# EAGLE design Drivetrain_control (EAGLE 9.3.2)

## Sheet 1 of 2: LAUNCHXL-F28379D Headers
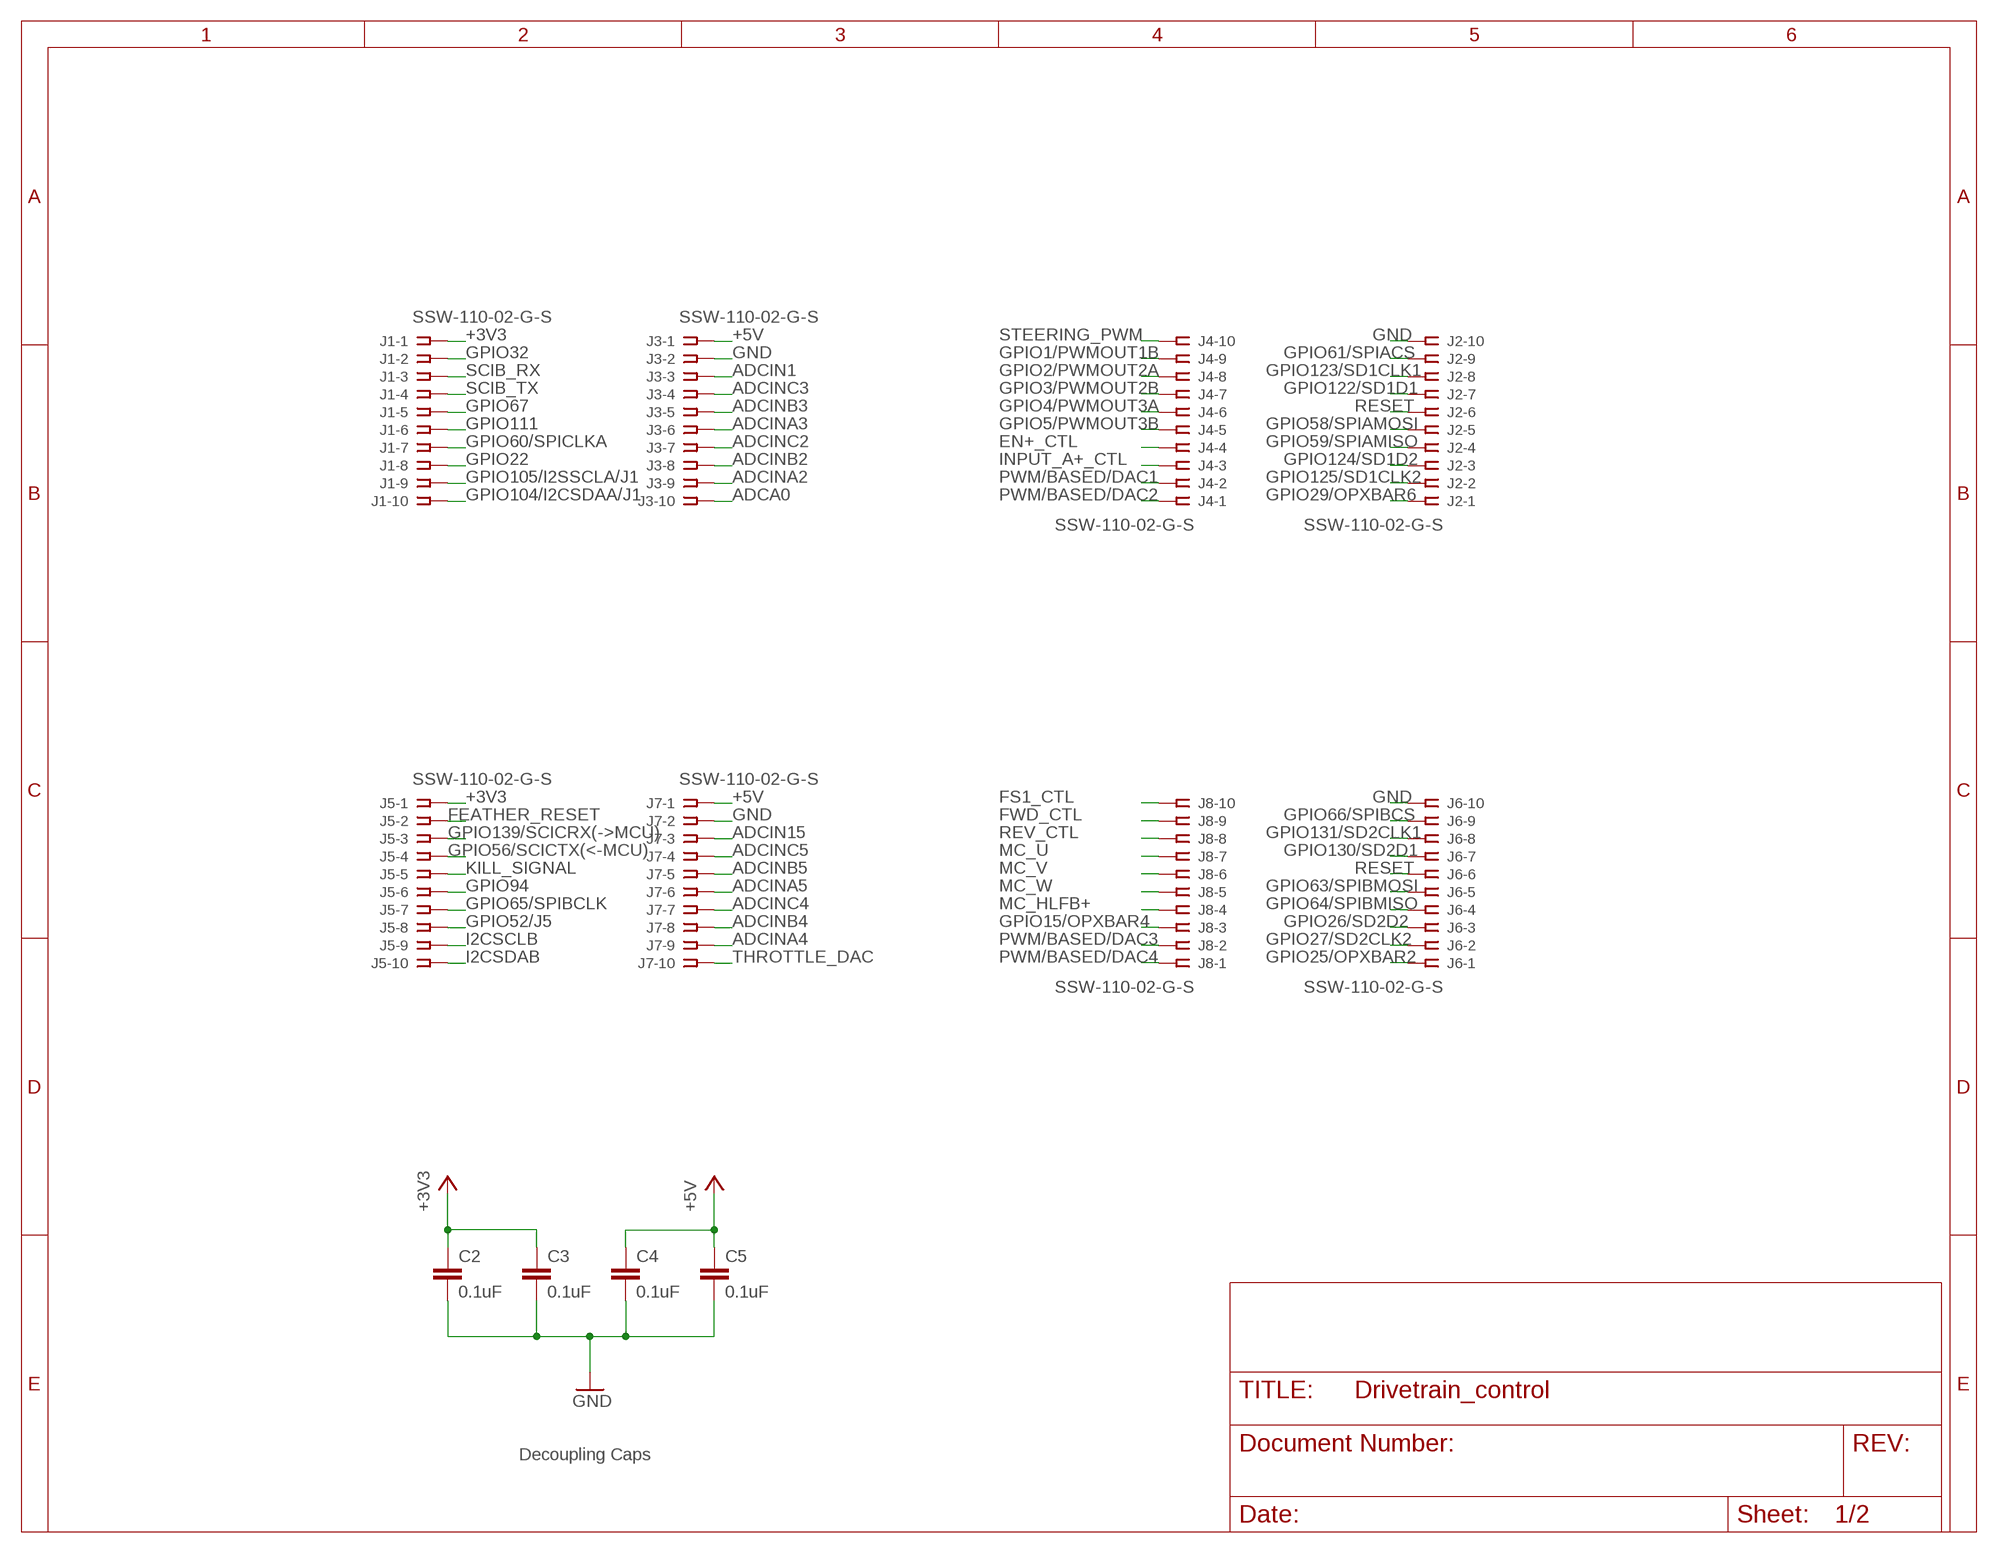
[diagram p0: schematic, sheet 1]

### Parts
C2  0.1uF  C  [C0805]
C3  0.1uF  C  [C0805]
C4  0.1uF  C  [C0805]
C5  0.1uF  C  [C0805]
J1  SSW-110-02-G-S  [SSW-110-02-G-S]
J2  SSW-110-02-G-S  [SSW-110-02-G-S]
J3  SSW-110-02-G-S  [SSW-110-02-G-S]
J4  SSW-110-02-G-S  [SSW-110-02-G-S]
J5  SSW-110-02-G-S  [SSW-110-02-G-S]
J6  SSW-110-02-G-S  [SSW-110-02-G-S]
J7  SSW-110-02-G-S  [SSW-110-02-G-S]
J8  SSW-110-02-G-S  [SSW-110-02-G-S]

### Nets
+3V3: C2.1 C3.1 J1.1 J5.1 ; also sheet 2
+5V: C4.1 C5.1 J3.1 J7.1 ; also sheet 2
ADCA0: J3.10
ADCIN1: J3.3
ADCIN15: J7.3
ADCINA2: J3.9
ADCINA3: J3.6
ADCINA4: J7.9
ADCINA5: J7.6
ADCINB2: J3.8
ADCINB3: J3.5
ADCINB4: J7.8
ADCINB5: J7.5
ADCINC2: J3.7
ADCINC3: J3.4
ADCINC4: J7.7
ADCINC5: J7.4
EN+_CTL: J4.4 ; also sheet 2
FEATHER_RESET: J5.2 ; also sheet 2
FS1_CTL: J8.10 ; also sheet 2
FWD_CTL: J8.9 ; also sheet 2
GND: C2.2 C3.2 C4.2 C5.2 J2.10 J3.2 J6.10 J7.2 ; also sheet 2
GPIO1/PWMOUT1B: J4.9
GPIO2/PWMOUT2A: J4.8
GPIO3/PWMOUT2B: J4.7
GPIO4/PWMOUT3A: J4.6
GPIO5/PWMOUT3B: J4.5
GPIO15/OPXBAR4: J8.3
GPIO22: J1.8
GPIO25/OPXBAR2: J6.1
GPIO26/SD2D2: J6.3
GPIO27/SD2CLK2: J6.2
GPIO29/OPXBAR6: J2.1
GPIO32: J1.2
GPIO52/J5: J5.8
GPIO56/SCICTX(<-MCU): J5.4
GPIO58/SPIAMOSI: J2.5
GPIO59/SPIAMISO: J2.4
GPIO60/SPICLKA: J1.7
GPIO61/SPIACS: J2.9
GPIO63/SPIBMOSI: J6.5
GPIO64/SPIBMISO: J6.4
GPIO65/SPIBCLK: J5.7
GPIO66/SPIBCS: J6.9
GPIO67: J1.5
GPIO94: J5.6
GPIO104/I2CSDAA/J1: J1.10
GPIO105/I2SSCLA/J1: J1.9
GPIO111: J1.6
GPIO122/SD1D1: J2.7
GPIO123/SD1CLK1: J2.8
GPIO124/SD1D2: J2.3
GPIO125/SD1CLK2: J2.2
GPIO130/SD2D1: J6.7
GPIO131/SD2CLK1: J6.8
GPIO139/SCICRX(->MCU): J5.3
I2CSCLB: J5.9 ; also sheet 2
I2CSDAB: J5.10 ; also sheet 2
INPUT_A+_CTL: J4.3 ; also sheet 2
KILL_SIGNAL: J5.5 ; also sheet 2
MC_HLFB+: J8.4 ; also sheet 2
MC_U: J8.7 ; also sheet 2
MC_V: J8.6 ; also sheet 2
MC_W: J8.5 ; also sheet 2
PWM/BASED/DAC1: J4.2
PWM/BASED/DAC2: J4.1
PWM/BASED/DAC3: J8.2
PWM/BASED/DAC4: J8.1
RESET: J2.6 J6.6
REV_CTL: J8.8 ; also sheet 2
SCIB_RX: J1.3 ; also sheet 2
SCIB_TX: J1.4 ; also sheet 2
STEERING_PWM: J4.10
THROTTLE_DAC: J7.10 ; also sheet 2

### Notes on the sheet
- Decoupling Caps

## Sheet 2 of 2: LAUNCHXL-F28379D Breakout
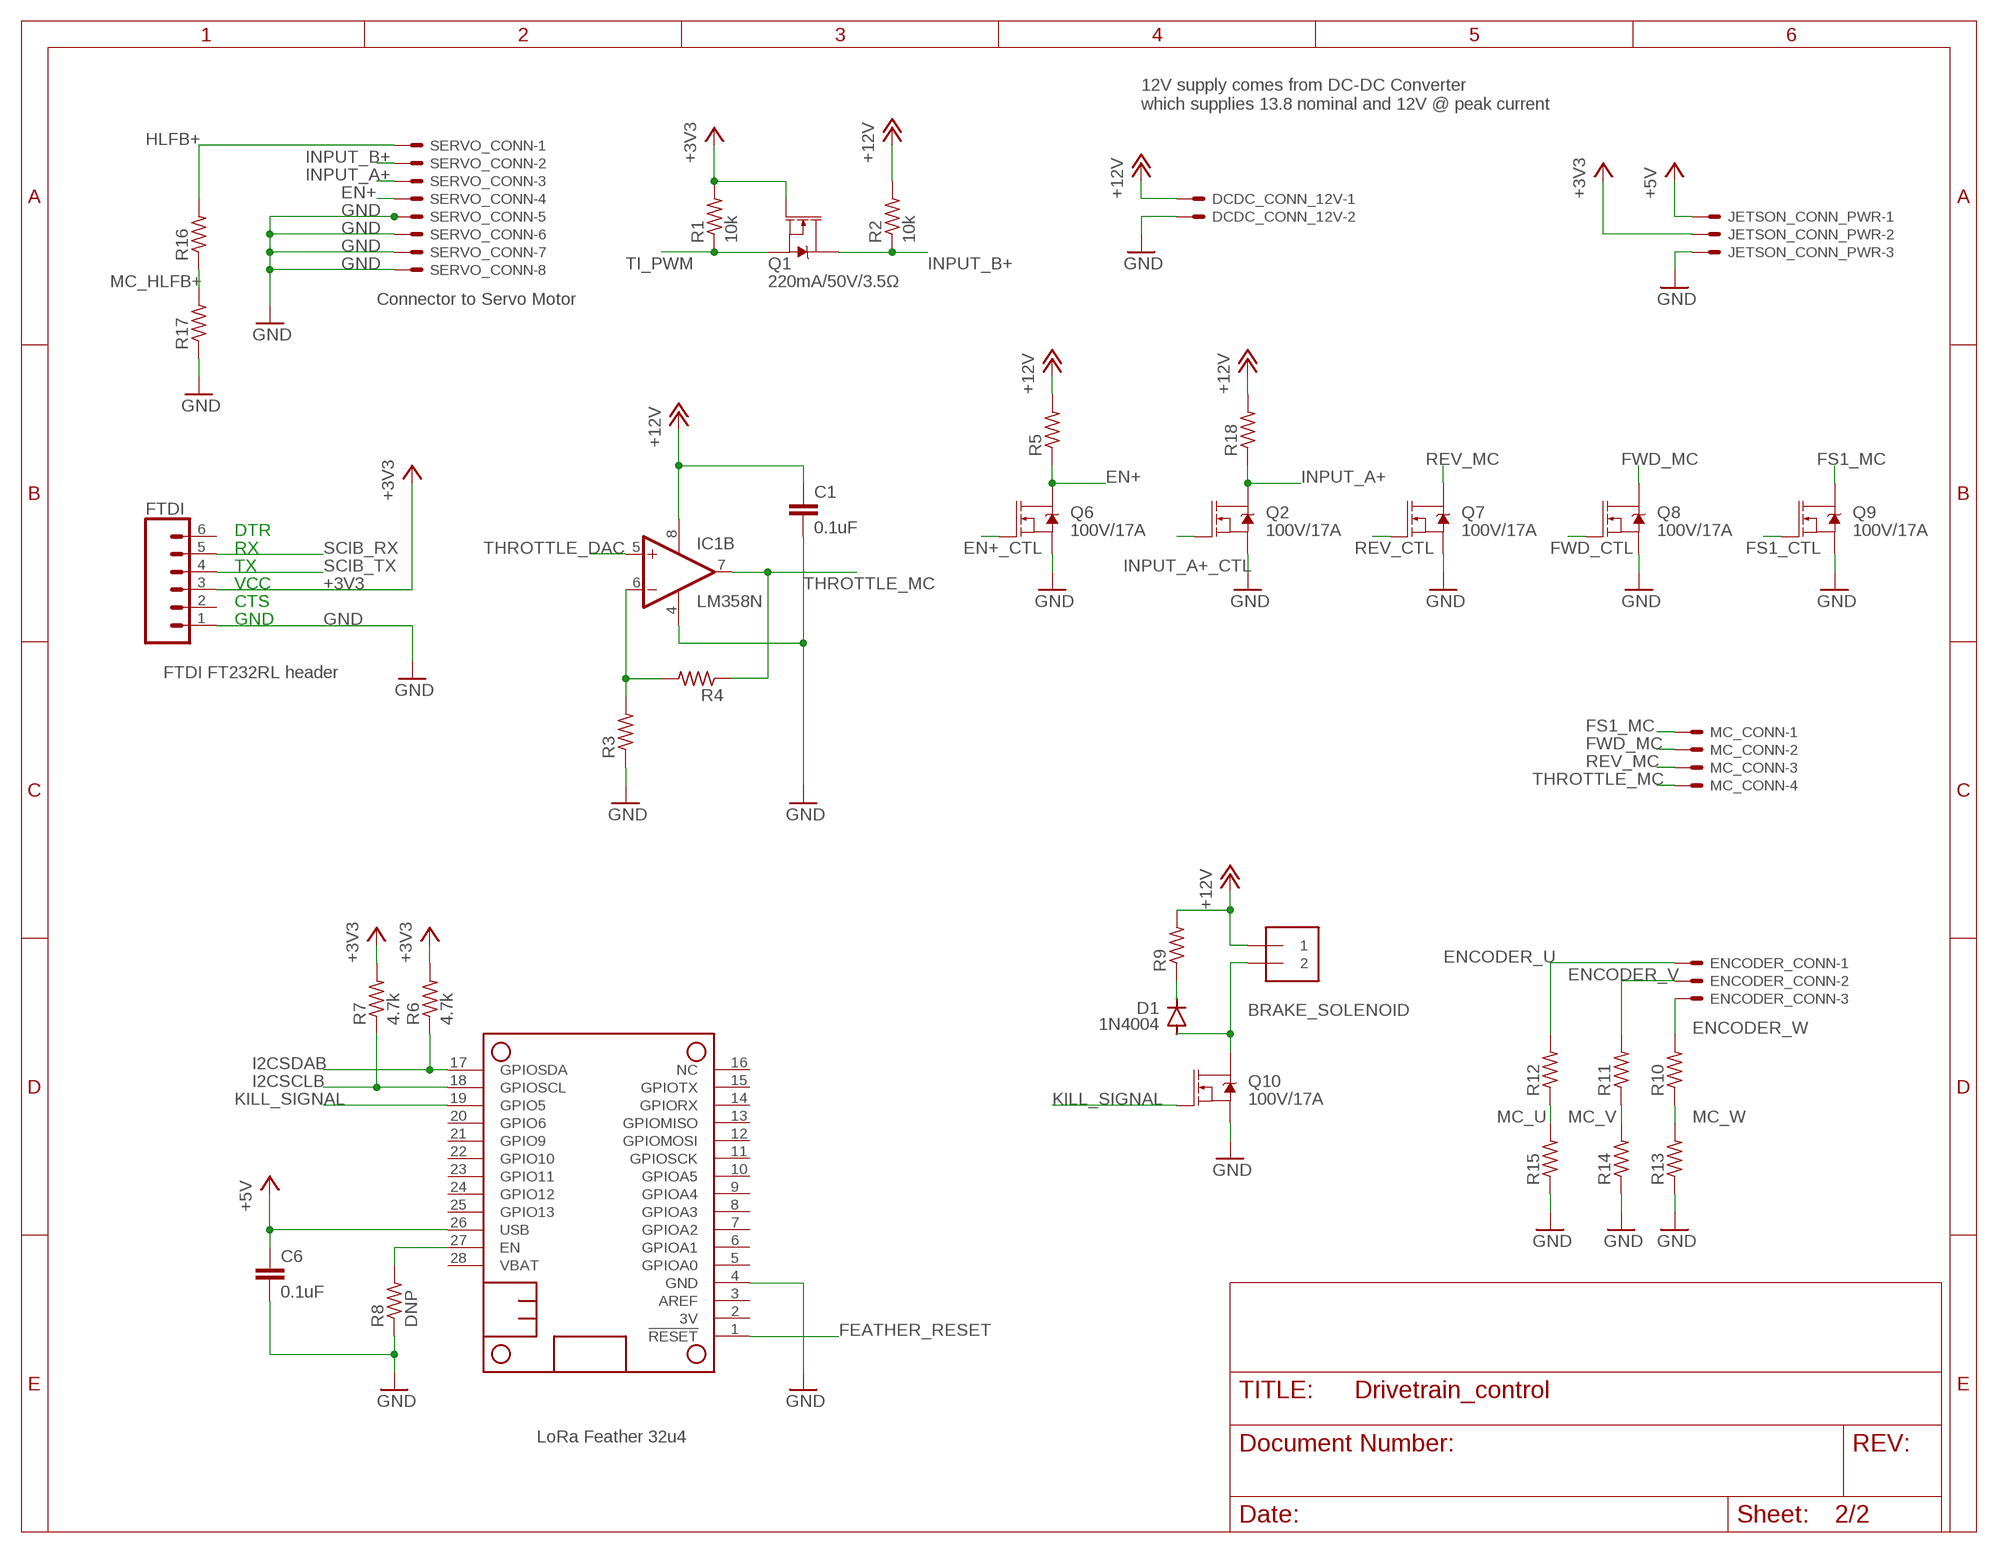
[diagram p1: schematic, sheet 2]

### Parts
BRAKE_CONN  1X2-3.5MM  [1X2-3.5MM]
C1  0.1uF  C  [C0805]
C6  0.1uF  C  [C0805]
D1  1N4004  [DO41-10]
DCDC_CONN_12V  22-23-2021  [22-23-2021]
ENCODER_CONN  22-23-2031  [22-23-2031]
FTDI  CONN_06LONGPADS  [1X06_LONGPADS]
IC1  LM358N  [DIL08]
JETSON_CONN_PWR  22-23-2031  [22-23-2031]
MC_CONN  22-23-2041  [22-23-2041]
MS1  FEATHERWING_NODIM  [FEATHERWING_DIM]
Q1  220mA/50V/3.5Ω  MOSFET-NCH-BSS138  [SOT23-3]
Q2  100V/17A  MOSFET-NCH-FQP30N06L  [TO220V]
Q6  100V/17A  MOSFET-NCH-FQP30N06L  [TO220V]
Q7  100V/17A  MOSFET-NCH-FQP30N06L  [TO220V]
Q8  100V/17A  MOSFET-NCH-FQP30N06L  [TO220V]
Q9  100V/17A  MOSFET-NCH-FQP30N06L  [TO220V]
Q10  100V/17A  MOSFET-NCH-FQP30N06L  [TO220V]
R1  10k  R-US_R0805  [R0805]
R2  10k  R-US_R0805  [R0805]
R3  R-US_R0805  [R0805]
R4  R-US_R0805  [R0805]
R5  R-US_R0805  [R0805]
R6  4.7k  R-US_R0805  [R0805]
R7  4.7k  R-US_R0805  [R0805]
R8  DNP  R-US_R0805  [R0805]
R9  R-US_R0805  [R0805]
R10  R-US_R0805  [R0805]
R11  R-US_R0805  [R0805]
R12  R-US_R0805  [R0805]
R13  R-US_R0805  [R0805]
R14  R-US_R0805  [R0805]
R15  R-US_R0805  [R0805]
R16  R-US_R0805  [R0805]
R17  R-US_R0805  [R0805]
R18  R-US_R0805  [R0805]
SERVO_CONN  5566-8  [5566-8]

### Nets
+3V3: FTDI.3 JETSON_CONN_PWR.2 Q1.1(G) R1.2 R6.2 R7.2 ; also sheet 1
+5V: C6.1 JETSON_CONN_PWR.1 MS1.26(USB) ; also sheet 1
+12V: BRAKE_CONN.1 C1.1 DCDC_CONN_12V.1 IC1.8(P:V+) R2.2 R5.2 R9.2 R18.2
BRAKE_SOLENOID: BRAKE_CONN.2 D1.A Q10.2(D)
EN+: Q6.2(D) R5.1 SERVO_CONN.4
EN+_CTL: Q6.1(G) ; also sheet 1
ENCODER_U: ENCODER_CONN.1 R12.2
ENCODER_V: ENCODER_CONN.2 R11.2
ENCODER_W: ENCODER_CONN.3 R10.2
FEATHER_RESET: MS1.1(!RESET) ; also sheet 1
FS1_CTL: Q9.1(G) ; also sheet 1
FS1_MC: MC_CONN.1 Q9.2(D)
FWD_CTL: Q8.1(G) ; also sheet 1
FWD_MC: MC_CONN.2 Q8.2(D)
GND: C1.2 C6.2 DCDC_CONN_12V.2 FTDI.1 IC1.4(P:V-) JETSON_CONN_PWR.3 MS1.4(GND) Q2.3(S) Q6.3(S) Q7.3(S) Q8.3(S) Q9.3(S) Q10.3(S) R3.1 R8.1 R13.1 R14.1 R15.1 R17.1 SERVO_CONN.5 SERVO_CONN.6 SERVO_CONN.7 SERVO_CONN.8 ; also sheet 1
HLFB+: R16.2 SERVO_CONN.1
I2CSCLB: MS1.18(GPIOSCL) R7.1 ; also sheet 1
I2CSDAB: MS1.17(GPIOSDA) R6.1 ; also sheet 1
INPUT_A+: Q2.2(D) R18.1 SERVO_CONN.3
INPUT_A+_CTL: Q2.1(G) ; also sheet 1
INPUT_B+: Q1.3(D) R2.1 SERVO_CONN.2
KILL_SIGNAL: MS1.19(GPIO5) Q10.1(G) ; also sheet 1
MC_HLFB+: R16.1 R17.2 ; also sheet 1
MC_U: R12.1 R15.2 ; also sheet 1
MC_V: R11.1 R14.2 ; also sheet 1
MC_W: R10.1 R13.2 ; also sheet 1
N$1: IC1.6(B:-IN) R3.2 R4.2
N$2: D1.C R9.1
N$3: MS1.27(EN) R8.2
REV_CTL: Q7.1(G) ; also sheet 1
REV_MC: MC_CONN.3 Q7.2(D)
SCIB_RX: FTDI.5 ; also sheet 1
SCIB_TX: FTDI.4 ; also sheet 1
THROTTLE_DAC: IC1.5(B:+IN) ; also sheet 1
THROTTLE_MC: IC1.7(B:OUT) MC_CONN.4 R4.1
TI_PWM: Q1.2(S) R1.1
Unconnected: FTDI.2 FTDI.6 IC1.1(A:OUT) IC1.2(A:-IN) IC1.3(A:+IN) MS1.2(3V) MS1.3(AREF) MS1.5(GPIOA0) MS1.6(GPIOA1) MS1.7(GPIOA2) MS1.8(GPIOA3) MS1.9(GPIOA4) MS1.10(GPIOA5) MS1.11(GPIOSCK) MS1.12(GPIOMOSI) MS1.13(GPIOMISO) MS1.14(GPIORX) MS1.15(GPIOTX) MS1.16(NC) MS1.20(GPIO6) MS1.21(GPIO9) MS1.22(GPIO10) MS1.23(GPIO11) MS1.24(GPIO12) MS1.25(GPIO13) MS1.28(VBAT)

### Notes on the sheet
- 12V supply comes from DC-DC Converter
  which supplies 13.8 nominal and 12V @ peak current
- Connector to Servo Motor
- DTR
- RX
- TX
- VCC
- CTS
- GND
- FTDI FT232RL header
- LoRa Feather 32u4

## Library data of the parts
BRAKE_CONN = adafruit:1X2: 3.5mm Terminal block http://www.ladyada.net/library/pcb/eaglelibrary.html
C1-C6 = eagle-ltspice:C: CAPACITOR, European symbol; SPICEMODEL: NONE; SPICEPREFIX: C
D1 = diode:1N4004: DIODE general purpose rectifier, 1 A
DCDC_CONN_12V = con-molex:22-23-2021: .100" (2.54mm) Center Header - 2 Pin; MF: MOLEX; MPN: 22-23-2021; OC_FARNELL: 1462926; OC_NEWARK: 25C3832
ENCODER_CONN JETSON_CONN_PWR = con-molex:22-23-2031: .100" (2.54mm) Center Header - 3 Pin; MF: MOLEX; MPN: 22-23-2031; OC_FARNELL: 1462950; OC_NEWARK: 30C0862
FTDI = SparkFun-Connectors:CONN_06: Multi connection point. Often used as Generic Header-pin footprint for 0.1 inch spaced/style header connections On any of the 0.1 inch spaced packages, you can populate with these: Break Away Headers - Straight <https://www.sparkfun.com/products/116> (PRT-00116) Break Away Male Headers - Right Angle <https://www.sparkfun.com/products/553> (PRT-00553) Female Headers <https://www.sparkfun.com/products/115> (PRT-00115) Break Away Headers - Machine Pin <https://www.sparkfun.com/products/117> (PRT-00117) Break Away Female Headers - Swiss Machine Pin <https://www.sparkfun.com/products/743> (PRT-00743) Arduino Stackable Header - 6 Pin <https://www.sparkfun.com/products/9280> (PRT-09280) For SCREWTERMINALS and SPRING TERMINALS visit here: Screw Terimnals on SparkFun.com <https://www.sparkfun.com/search/results?term=Screw+Terminals> (5mm/3.5mm/2.54mm spacing) This device is also useful as a general connection point to wire up your design to another part of your project. Our various solder wires solder well into these plated through hole pads. Hook-Up Wire - Assortment (Stranded, 22 AWG) <https://www.sparkfun.com/products/11375> (PRT-11375) Hook-Up Wire - Assortment (Solid Core, 22 AWG) <https://www.sparkfun.com/products/11367> (PRT-11367) View the entire wire category on our website here <https://www.sparkfun.com/categories/141>
IC1 = linear:LM358: OP AMP also LM158; LM258; LM2904 Source: http://cache.national.com/ds/LM/LM158.pdf
J1-J8 = con-samtec:SSW-110-02-G-S: THROUGH-HOLE .025" SQ POST SOCKET Source: Samtec SSW.pdf; MF: Samtec Inc.; MPN: SSW-110-02-G-S; OC_FARNELL: unknown; OC_NEWARK: 11P9482
MC_CONN = con-molex:22-23-2041: .100" (2.54mm) Center Header - 4 Pin; MF: MOLEX; MPN: 22-23-2041; OC_FARNELL: 1462920; OC_NEWARK: 38C0355
MS1 = adafruit:FEATHERWING
Q1 = SparkFun-DiscreteSemi:MOSFET-NCH: N-channel MOSFETs Voltage controlled devices that allow control of high current outputs. SparkFun Products: SparkFun OpenScale <https://www.sparkfun.com/products/13261> SparkFun Digital Sandbox <https://www.sparkfun.com/products/12651> SparkFun Monster Moto Shield <https://www.sparkfun.com/products/10182> SparkFun MOSFET Power Controller <https://www.sparkfun.com/products/11214>; PROD_ID: TRANS-00830
Q2 Q6-Q10 = SparkFun-DiscreteSemi:MOSFET-NCH: N-channel MOSFETs Voltage controlled devices that allow control of high current outputs. SparkFun Products: SparkFun OpenScale <https://www.sparkfun.com/products/13261> SparkFun Digital Sandbox <https://www.sparkfun.com/products/12651> SparkFun Monster Moto Shield <https://www.sparkfun.com/products/10182> SparkFun MOSFET Power Controller <https://www.sparkfun.com/products/11214>; PROD_ID: TRANS-10060; VALUE: 60V/32A/35mΩ
R1-R18 = resistor:R-US_: RESISTOR, American symbol
SERVO_CONN = con-molex:5566-8: Mini FIT connector 8 pol Source: http://www.molex.com; MF: MOLEX; OC_FARNELL: unknown; OC_NEWARK: unknown

## Board
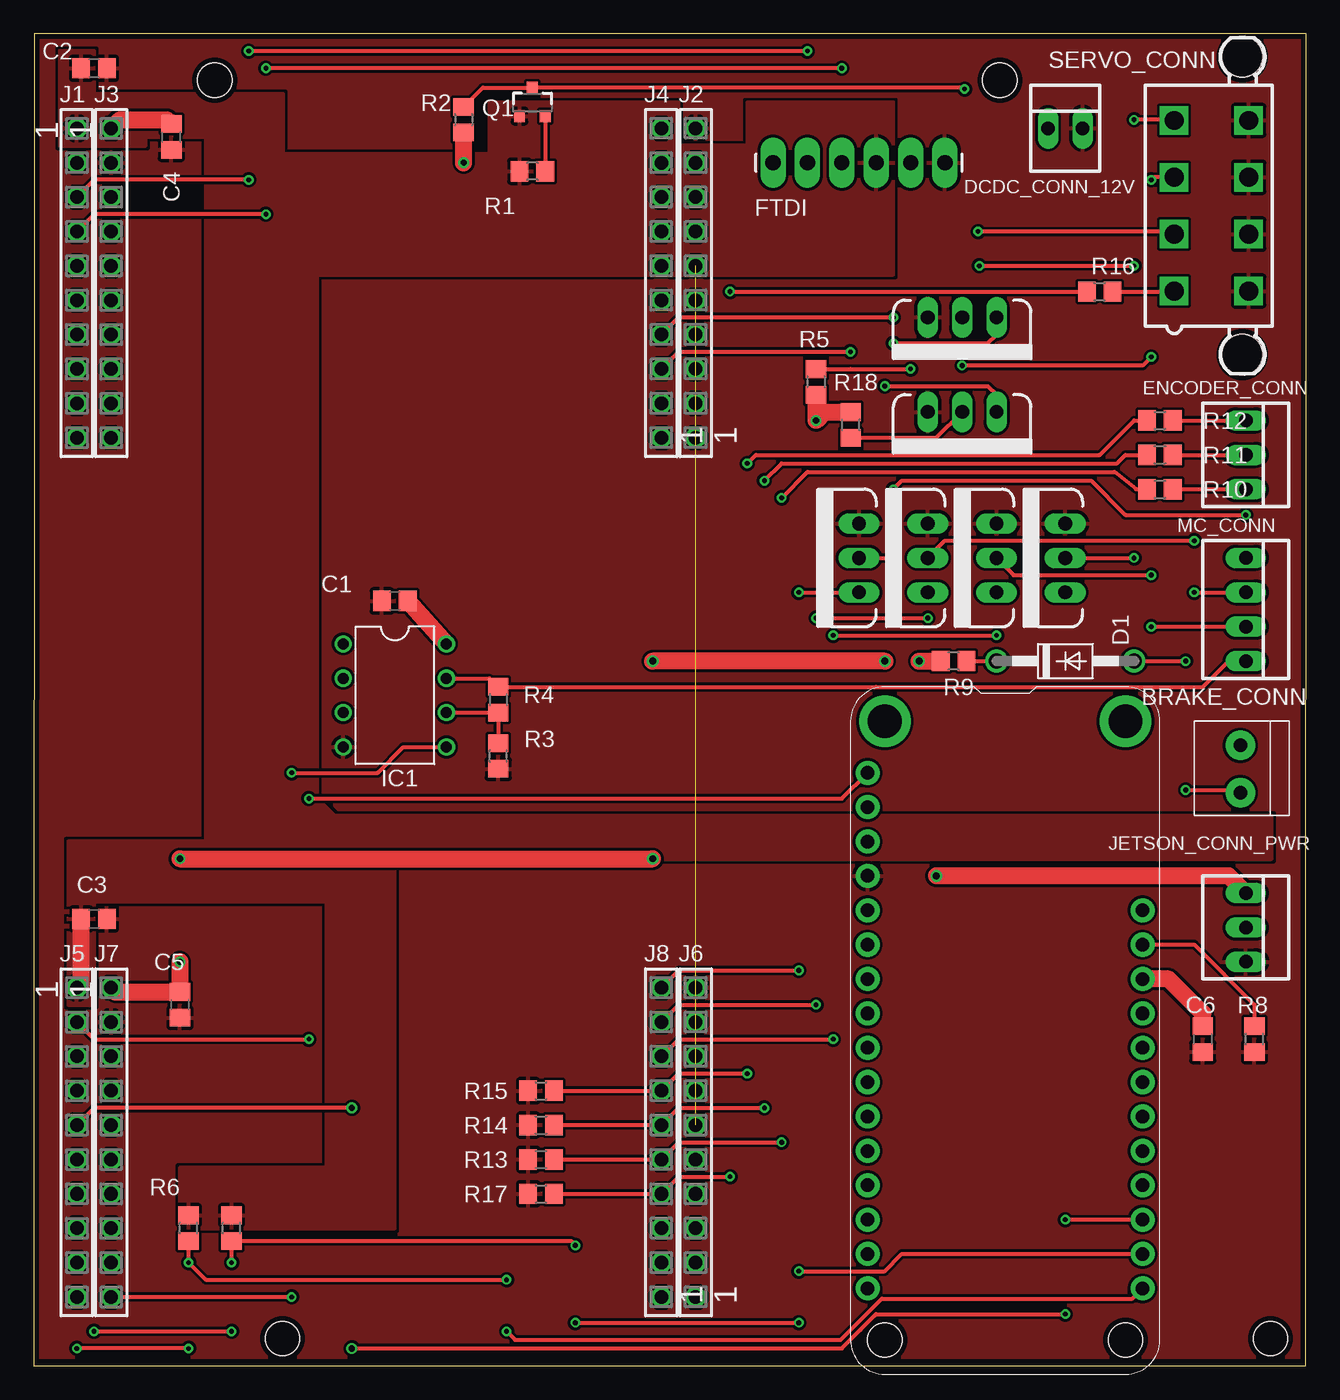
[diagram p2: board, top side]
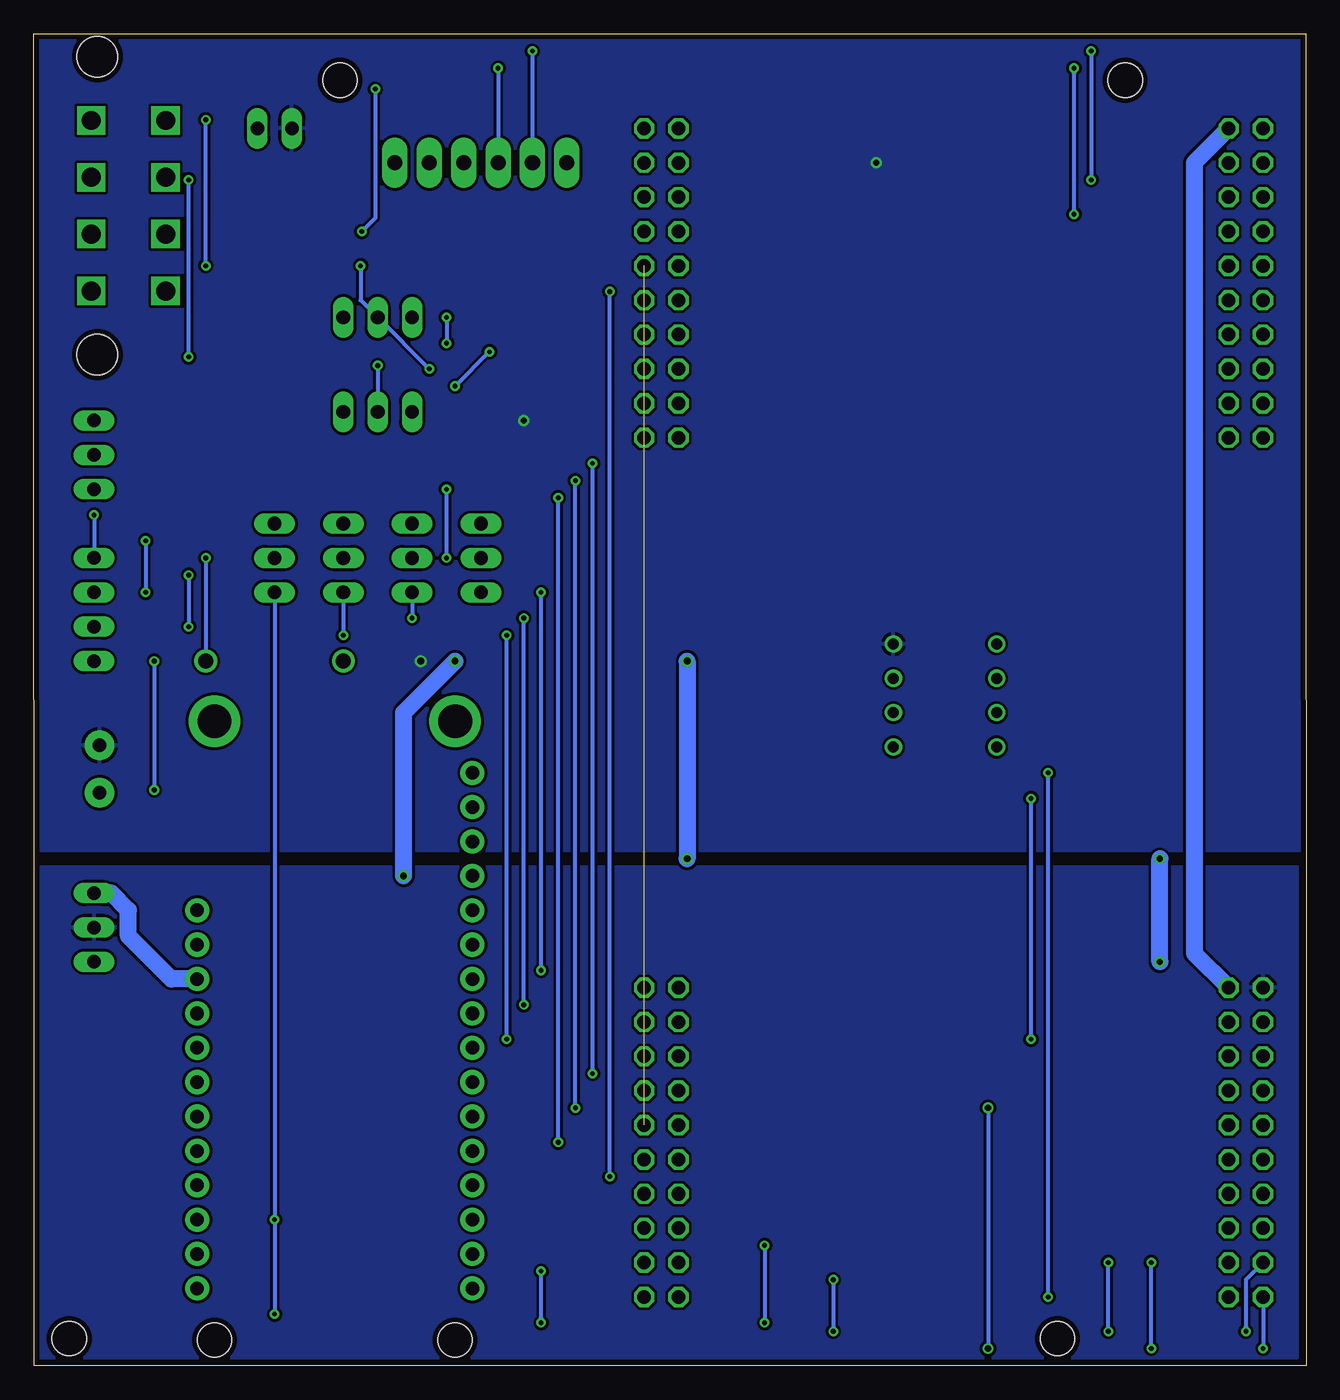
[diagram p3: board, bottom side, seen from below]

Size 93.99 x 98.43 mm. Coordinates in mm from the lower left corner, seen from the top.
Outline: 0,0 93.96,0 93.98,98.42 0.03,98.42 0,0
Copper layers (1*16): Top 0.0356mm / dielectric 1.5011mm / Bottom 0.0356mm
Design rules "ECE_Senior_Design": minimum track width 8mil, minimum drill 13mil, track to track 8mil, track to pad 8mil, pad to pad 6mil, via to via 8mil, smd to smd 6mil, copper to edge 15mil, drill to drill 8mil, minimum pad ring 7mil, minimum via ring 7mil, stop-mask expansion 3mil, vias tented up to drill 0mil, thermal gap 10mil
Holes 2.54 mm at 91.36,2 18.36,2 13.37,95 71.36,95

### Footprints (pad centres in the part's own frame; a part is rotated, then mirrored left to right if it is on the bottom)
1X2-3.5MM = drill 1 pad 2.184: 1 1.8,0; 2 -1.7,0
C0805 = smd 1.3 x 1.5: 1 -0.95,0; 2 0.95,0
DO41-10 = drill 1.118: A 5.08,0; C -5.08,0
22-23-2021 = drill 1 long: 1 -1.27,0; 2 1.27,0
22-23-2031 = drill 1 long: 1 -2.54,0; 2 0,0; 3 2.54,0
1X06_LONGPADS = drill 1.118 pad 1.88 long: 1 0,0; 2 2.54,0; 3 5.08,0; 4 7.62,0; 5 10.16,0; 6 12.7,0
DIL08 = drill 0.813 pad 1.27: 1 -3.81,-3.81; 2 -1.27,-3.81; 3 1.27,-3.81; 4 3.81,-3.81; 5 3.81,3.81; 6 1.27,3.81; 7 -1.27,3.81; 8 -3.81,3.81
SSW-110-02-G-S = drill 1 pad 1.5 octagon: 1 -11.43,0; 2 -8.89,0; 3 -6.35,0; 4 -3.81,0; 5 -1.27,0; 6 1.27,0; 7 3.81,0; 8 6.35,0; 9 8.89,0; 10 11.43,0
22-23-2041 = drill 1 long: 1 -3.81,0; 2 -1.27,0; 3 1.27,0; 4 3.81,0
FEATHERWING_DIM = drill 1 pad 1.778: 1 6.35,1.27; 2 8.89,1.27; 3 11.43,1.27; 4 13.97,1.27; 5 16.51,1.27; 6 19.05,1.27; 7 21.59,1.27; 8 24.13,1.27; 9 26.67,1.27; 10 29.21,1.27; 11 31.75,1.27; 12 34.29,1.27; 13 36.83,1.27; 14 39.37,1.27; 15 41.91,1.27; 16 44.45,1.27; 17 44.45,21.59; 18 41.91,21.59; 19 39.37,21.59; 20 36.83,21.59; 21 34.29,21.59; 22 31.75,21.59; 23 29.21,21.59; 24 26.67,21.59; 25 24.13,21.59; 26 21.59,21.59; 27 19.05,21.59; 28 16.51,21.59 | drill 2.5 pad 3.81: P$1 2.54,20.32; P$2 2.54,2.54 | hole 2.54: 48.26,20.32; 48.26,2.54
SOT23-3 = smd 0.8 x 0.9: 1 -0.95,-1; 2 0.95,-1; 3 0,1.1
TO220V = drill 1.016 long: 1 -2.54,0; 2 0,0; 3 2.54,0
R0805 = smd 1.3 x 1.5: 1 -0.95,0; 2 0.95,0
5566-8 = drill 1.4 square: 1 6.3,-2.75; 2 2.1,-2.75; 3 -2.1,-2.75; 4 -6.3,-2.75; 5 6.3,2.75; 6 2.1,2.75; 7 -2.1,2.75; 8 -6.3,2.75 | hole 3: 11,2.29; -11,2.29

### Placement (x,y rotation side)
BRAKE_CONN  89.13,44.04 90 top
C1  26.67,56.52 180 top
C2  4.45,95.89 0 top
C3  4.45,33.02 0 top
C4  10.16,90.81 270 top
C5  10.79,26.67 270 top
C6  86.36,24.13 270 top
D1  76.2,52.07 0 top
DCDC_CONN_12V  76.2,91.44 0 top
ENCODER_CONN  89.53,67.31 270 top
FTDI  67.31,88.9 180 top
IC1  26.67,49.53 270 top
J1  3.17,80.01 270 top
J2  48.9,80.01 90 top
J3  5.71,80.01 270 top
J4  46.36,80.01 90 top
J5  3.17,16.51 270 top
J6  48.9,16.51 90 top
J7  5.71,16.51 270 top
J8  46.36,16.51 90 top
JETSON_CONN_PWR  89.53,32.38 270 top
MC_CONN  89.53,55.88 270 top
MS1  60.33,50.16 270 top
Q1  36.83,93.34 0 top
Q2  68.58,70.48 180 top
Q6  68.58,77.47 180 top
Q7  71.12,59.69 90 top
Q8  66.04,59.69 90 top
Q9  60.96,59.69 90 top
Q10  76.2,59.69 90 top
R1  36.83,88.27 180 top
R2  31.75,92.08 270 top
R3  34.32,45.06 90 top
R4  34.32,49.21 270 top
R5  57.79,72.69 270 top
R6  11.43,10.16 90 top
R7  14.61,10.16 90 top
R8  90.17,24.13 90 top
R9  67.94,52.07 180 top
R10  83.18,64.77 0 top
R11  83.18,67.31 0 top
R12  83.18,69.85 0 top
R13  37.47,15.24 0 top
R14  37.47,17.78 0 top
R15  37.47,20.32 0 top
R16  78.74,79.38 0 top
R17  37.47,12.7 0 top
R18  60.35,69.52 90 top
SERVO_CONN  86.99,85.72 270 top

### Tracks (layer width: path | path; a pad name or v marks a point on that pad's centre or on a via)
+3V3
  Top 1.27: J5.1 arc90 3.5,28.26 C3.1
  pour Bottom: 0.64,36.83 93.98,36.83 93.98,0.64 0.64,0.64
  pour Top: 1.91,90.17 8.26,90.17 8.26,90.81 12.7,90.81 12.7,38.73 2.54,38.73 2.54,26.67 4.45,26.67 4.45,34.29 21.59,34.29 21.59,14.61 10.79,14.61 10.79,10.16 26.67,10.16 26.67,37.47 91.44,37.47 91.44,40.64 22.22,40.64 20.95,41.91 20.95,80.64 63.5,80.64 63.5,93.34 52.71,93.34 52.71,90.17 47.62,90.17 47.62,93.34 33.66,93.34 33.66,89.53 18.41,89.53 18.41,93.98 4.45,93.98 4.45,97.16 1.91,97.16
+5V  (via drill 0.45, 0.5)
  Top 1.27: J7.1 6.04,27.62 C5.1 v10.79,29.84 | J3.1 6.35,92.08 9.84,92.08 C4.1 | C6.1 86.36,26.04 83.82,28.57 MS1.26 | JETSON_CONN_PWR.1 88.27,36.2 v66.67,36.2 | v62.87,52.07 v45.72,52.07 | v10.79,37.47 v45.72,37.47
  Bottom 1.27: J3.1 8.26,88.9 8.26,30.48 J7.1 | v10.79,29.84 v10.79,37.47 | MS1.26 83.82,28.57 86.99,31.75 86.99,33.66 88.27,34.92 JETSON_CONN_PWR.1 | v66.67,36.2 66.67,48.26 v62.87,52.07 | v45.72,52.07 v45.72,37.47
+12V  (via drill 0.45, 0.5)
  Top 1.27: R5.2 v57.79,69.85 58.41,70.47 R18.2 | v31.75,88.9 R2.2 | C1.1 IC1.8 | v65.41,52.07 R9.2
  pour Bottom: 0,98.42 93.98,98.42 93.98,38.1 0,38.1
BRAKE_SOLENOID  (via drill 0.35)
  Top 0.305: Q10.2 v81.28,59.69 | D1.A v85.09,52.07 | v85.09,42.55 88.9,42.55 BRAKE_CONN.2
  Bottom 0.305: v81.28,59.69 D1.A | v85.09,52.07 v85.09,42.55
EN+  (via drill 0.35)
  Top 0.305: R5.1 60.33,73.66 v64.77,73.66 | v69.85,81.28 v81.28,81.28 | SERVO_CONN.4 84.19,92.08 v81.28,92.08
  Bottom 0.305: v69.85,81.28 69.85,78.74 Q6.2 v64.77,73.66 | v81.28,81.28 v81.28,92.08
EN+_CTL  (via drill 0.35)
  Top 0.305: J4.4 47.62,77.47 v63.5,77.47 | v63.5,75.56 70.48,75.56 71.12,76.2 Q6.1
  Bottom 0.305: v63.5,77.47 v63.5,75.56
ENCODER_U
  Top 0.305: R12.2 ENCODER_CONN.1
ENCODER_V
  Top 0.305: R11.2 ENCODER_CONN.2
ENCODER_W
  Top 0.305: R10.2 ENCODER_CONN.3
FEATHER_RESET  (via drill 0.35)
  Top 0.305: J5.2 4.45,24.13 v20.32,24.13 | v20.32,41.91 59.69,41.91 MS1.1
  Bottom 0.305: v20.32,24.13 v20.32,41.91
FS1_CTL  (via drill 0.35)
  Top 0.305: J8.10 47.62,29.21 v56.52,29.21 | v56.52,57.15 Q9.1
  Bottom 0.305: v56.52,29.21 v56.52,57.15
FS1_MC  (via drill 0.35)
  Top 0.305: v89.53,62.87 80.64,62.87 78.1,65.41 64.13,65.41 v63.5,64.77 | Q9.2 v63.5,59.69
  Bottom 0.305: v89.53,62.87 MC_CONN.1 | v63.5,59.69 v63.5,64.77
FWD_CTL  (via drill 0.35)
  Top 0.305: J8.9 47.62,26.67 v57.79,26.67 | v57.79,55.24 v66.04,55.24
  Bottom 0.305: v57.79,26.67 v57.79,55.24 | Q8.1 v66.04,55.24
FWD_MC  (via drill 0.35)
  Top 0.305: v85.72,57.15 MC_CONN.2 | Q8.2 67.31,60.96 v85.72,60.96
  Bottom 0.305: v85.72,60.96 v85.72,57.15
GND
  pour Top (rank 2): 0,98.42 93.98,98.42 93.98,0.64 0,0.64
HLFB+
  Top 0.305: SERVO_CONN.1 83.18,79.38 R16.2
I2CSCLB  (via drill 0.35)
  Top 0.305: v4.45,2.54 v14.61,2.54 | v14.61,7.62 R7.1 39.69,9.21 v40.01,8.89 | v40.01,3.17 v56.52,3.17 | v56.52,6.99 62.87,6.99 64.13,8.26 MS1.18
  Bottom 0.305: J5.9 4.45,6.35 v4.45,2.54 | v14.61,2.54 v14.61,7.62 | v40.01,8.89 v40.01,3.17 | v56.52,3.17 v56.52,6.99
I2CSDAB  (via drill 0.35)
  Top 0.305: v11.43,1.27 v3.17,1.27 | R6.1 v11.43,7.62 12.7,6.35 v34.93,6.35 | MS1.17 81.15,4.95 62.64,4.95 59.6,1.91 35.56,1.91 v34.93,2.54
  Bottom 0.305: J5.10 v3.17,1.27 | v11.43,1.27 v11.43,7.62 | v34.93,6.35 v34.93,2.54
INPUT_A+  (via drill 0.35)
  Top 0.305: v82.55,74.55 81.91,73.91 v68.58,73.91 | SERVO_CONN.3 82.74,87.83 v82.55,87.63 | R18.1 66.66,68.57 Q2.2
  Bottom 0.305: v68.58,73.91 Q2.2 | v82.55,74.55 v82.55,87.63
INPUT_A+_CTL  (via drill 0.35)
  Top 0.305: J4.3 47.62,74.93 v60.33,74.93 | v62.87,72.39 70.48,72.39 71.12,71.75 Q2.1
  Bottom 0.305: v60.33,74.93 v62.87,72.39
INPUT_B+  (via drill 0.35)
  Top 0.305: R2.1 33.17,94.44 Q1.3 68.66,94.44 v68.75,94.34 | SERVO_CONN.2 84.05,83.82 v69.75,83.82
  Bottom 0.305: v68.75,94.34 68.75,84.82 v69.75,83.82
KILL_SIGNAL  (via drill 0.35, 0.45)
  Top 0.305: v23.49,19.05 4.45,19.05 J5.5 | MS1.19 v76.2,10.79 | v23.49,1.27 59.69,1.27 61.06,2.64 61.06,2.65 62.12,3.71 62.13,3.71 62.23,3.81 v76.2,3.81
  Bottom 0.305: v23.49,19.05 v23.49,1.27 | v76.2,3.81 v76.2,10.79 Q10.1
MC_HLFB+  (via drill 0.35)
  Top 0.305: R17.2 J8.4 47.62,13.97 v51.44,13.97 | v51.44,79.38 R16.1
  Bottom 0.305: v51.44,13.97 v51.44,79.38
MC_U  (via drill 0.35)
  Top 0.305: R15.2 J8.7 47.62,21.59 v52.71,21.59 | v52.71,66.67 53.34,67.31 78.74,67.31 81.28,69.85 R12.1
  Bottom 0.305: v52.71,21.59 v52.71,66.67
MC_V  (via drill 0.35)
  Top 0.305: R14.2 J8.6 47.62,19.05 v53.98,19.05 | v53.98,65.41 55.25,66.67 80.01,66.67 80.64,67.31 R11.1
  Bottom 0.305: v53.98,19.05 v53.98,65.41
MC_W  (via drill 0.35)
  Top 0.305: R13.2 J8.5 47.62,16.51 v55.25,16.51 | v55.25,64.14 57.15,66.04 79.85,66.04 81.44,64.77 R10.1
  Bottom 0.305: v55.25,16.51 v55.25,64.14
N$1
  Top 0.305: IC1.6 33.02,48.26 R4.2 R3.2
N$2
  Top 0.305: R9.1 D1.C
N$3
  Top 0.305: R8.2 90.17,26.67 85.72,31.11 MS1.27
RESET  (1 unrouted)
REV_CTL  (via drill 0.35)
  Top 0.305: J8.8 47.62,24.13 v59.05,24.13 | v59.05,53.98 v71.12,53.98
  Bottom 0.305: v59.05,24.13 v59.05,53.98 | Q7.1 v71.12,53.98
REV_MC  (via drill 0.35)
  Top 0.305: Q7.2 72.39,58.42 v82.55,58.42 | v82.55,54.61 MC_CONN.3
  Bottom 0.305: v82.55,58.42 v82.55,54.61
SCIB_RX  (via drill 0.35)
  Top 0.305: v57.15,97.16 v15.88,97.16 | v15.88,87.63 4.45,87.63 J1.3
  Bottom 0.305: v57.15,97.16 FTDI.5 | v15.88,97.16 v15.88,87.63
SCIB_TX  (via drill 0.35)
  Top 0.305: v59.69,95.89 v17.14,95.89 | v17.14,85.09 4.45,85.09 J1.4
  Bottom 0.305: v59.69,95.89 FTDI.4 | v17.14,95.89 v17.14,85.09
THROTTLE_DAC  (via drill 0.35)
  Top 0.305: J7.10 v19.05,5.08 | v19.05,43.81 25.4,43.81 27.3,45.72 IC1.5
  Bottom 0.305: v19.05,5.08 v19.05,43.81
THROTTLE_MC
  Top 0.305: IC1.7 33.66,50.8 R4.1 62.23,50.16 86.36,50.16 88.27,52.07 MC_CONN.4
TI_PWM
  Top 0.305: Q1.2 R1.1